# EAGLE design MAX6675-Breakout (EAGLE 5.12)
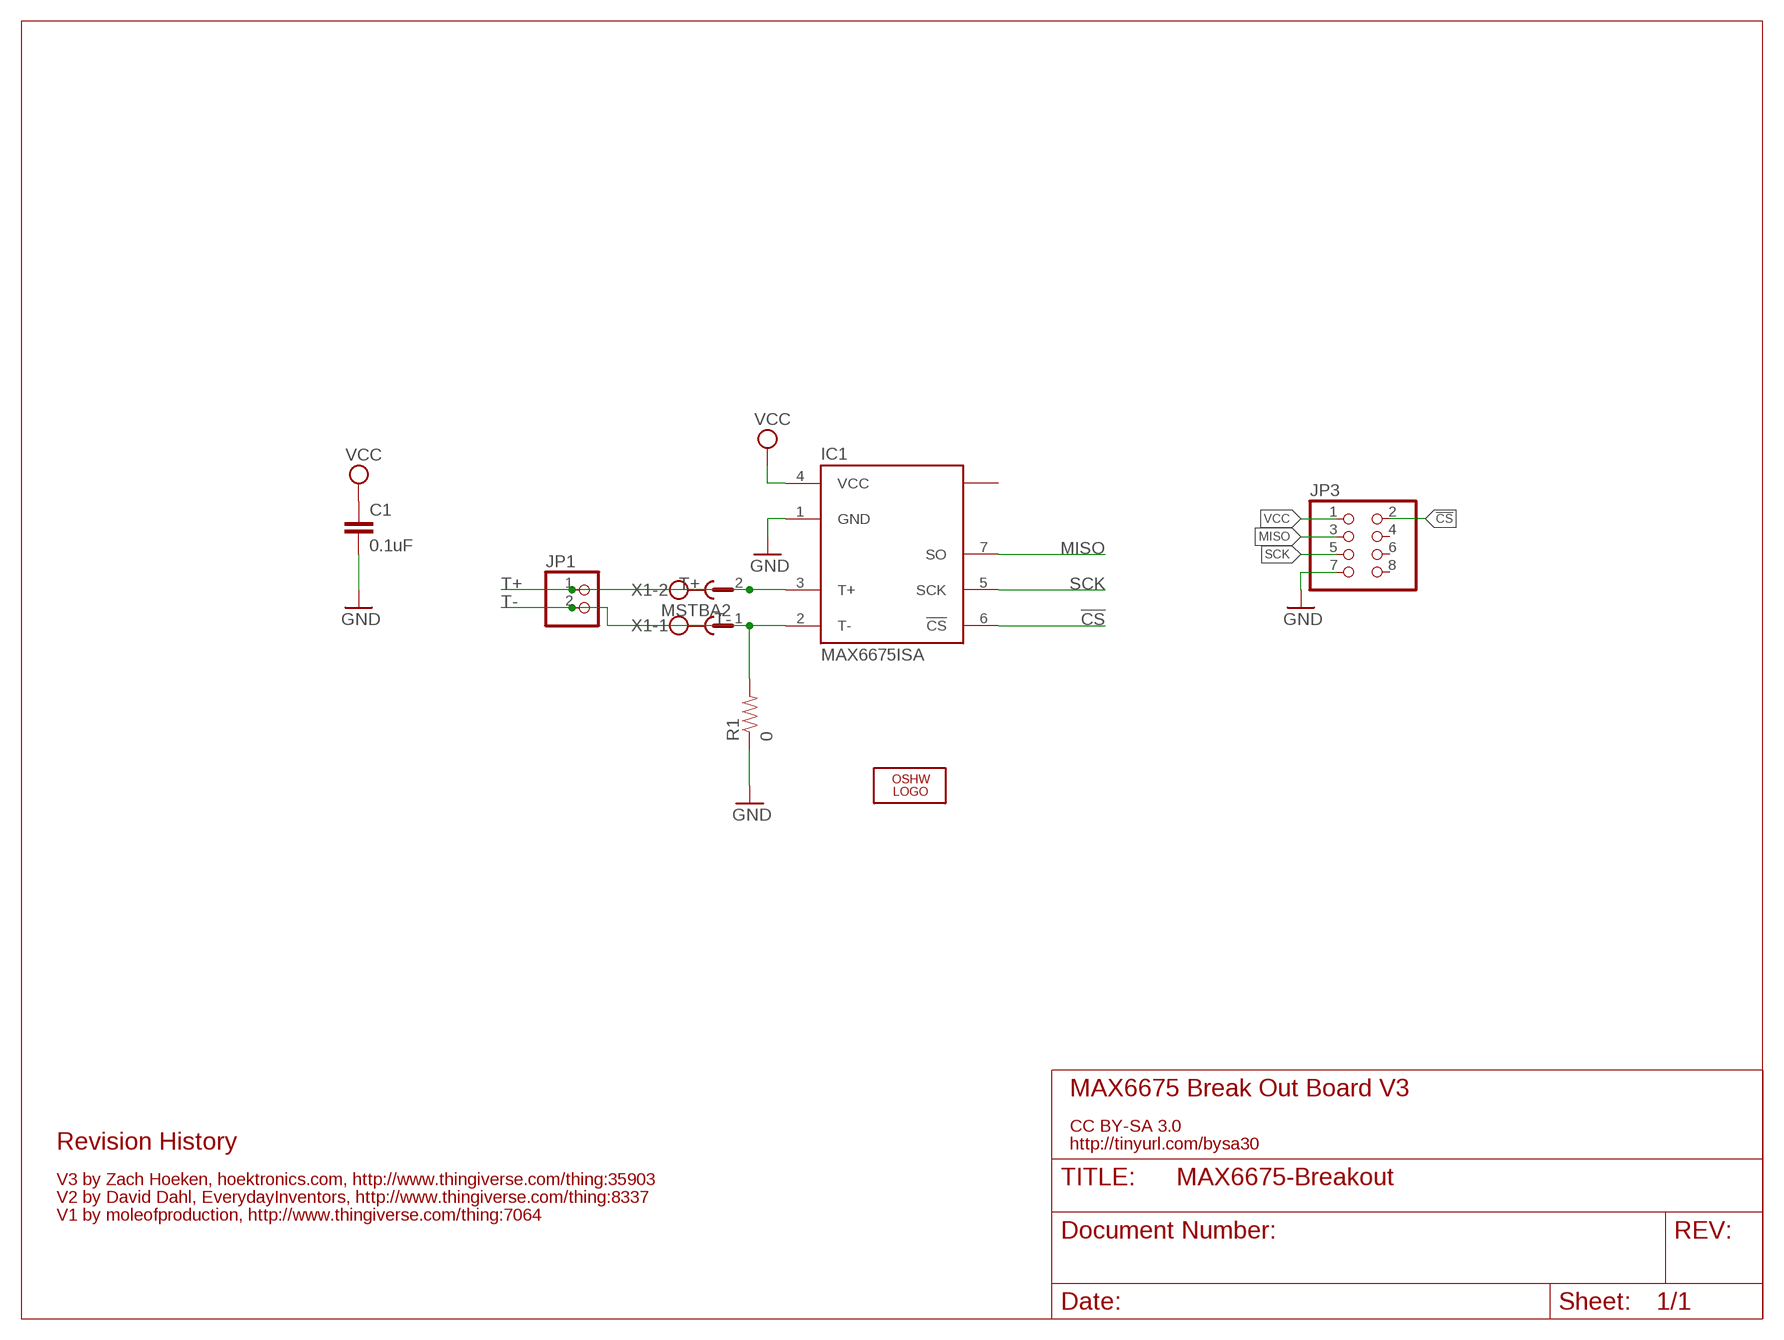
[diagram p0: schematic, sheet 1]

## Parts
C1  0.1uF  CAPACITOR0805  [0805-RC]
IC1  MAX6675ISA  [SO08]
JP1  PINHD-1X2  [1X02]
JP3  PINHD-2X4/90  [2X04/90]
LOGO1  OSHW_LOGO_6MILX0100-NT  [OSHW_6X100_NOTEXT]
R1  0  RESISTOR0805  [0805-RC]
X1  MSTBA2  [MSTBA2]

## Nets
!CS: IC1.6(!CS) JP3.2
GND: C1.2 IC1.1(GND) JP3.7 R1.1
MISO: IC1.7(SO) JP3.3
SCK: IC1.5(SCK) JP3.5
T+: IC1.3(T+) JP1.1 X1.2
T-: IC1.2(T-) JP1.2 R1.2 X1.1
VCC: C1.1 IC1.4(VCC) JP3.1
Unconnected: IC1.8(NC) JP3.4 JP3.6 JP3.8

## Notes on the sheet
- MAX6675 Break Out Board V3
- CC BY-SA 3.0
- Revision History | http://tinyurl.com/bysa30
- V3 by Zach Hoeken, hoektronics.com, http://www.thingiverse.com/thing:35903
- V2 by David Dahl, EverydayInventors, http://www.thingiverse.com/thing:8337
- V1 by moleofproduction, http://www.thingiverse.com/thing:7064

## Library data of the parts
C1 = Hoektronics:CAPACITOR: Capacitor Standard 0603 ceramic capacitor, and 0.1" leaded capacitor.
IC1 = ei-thermocouple:MAX6675ISA: Maxim Cold-Junction-Compensated K-Thermocouple-to-Digital Converter (0C to +1024C)
JP1 = pinhead:PINHD-1X2: PIN HEADER
JP3 = pinhead:PINHD-2X4: PIN HEADER
LOGO1 = ohw-logo:OSHW_LOGO_6MIL
R1 = Hoektronics:RESISTOR: Resistor Basic schematic elements and footprints for 0603, 1206, and PTH 1/10th watt (small) resistors.
X1 = con-phoenix-508:MSTBA2: PHOENIX; MF: FARNELL; MPN: 1757242; OC_FARNELL: 3705171; OC_NEWARK: 71C4161

## Board
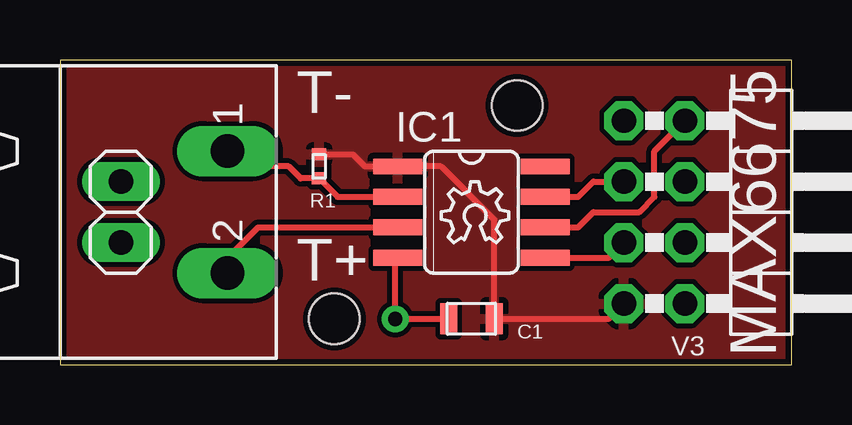
[diagram p1: board, top side]
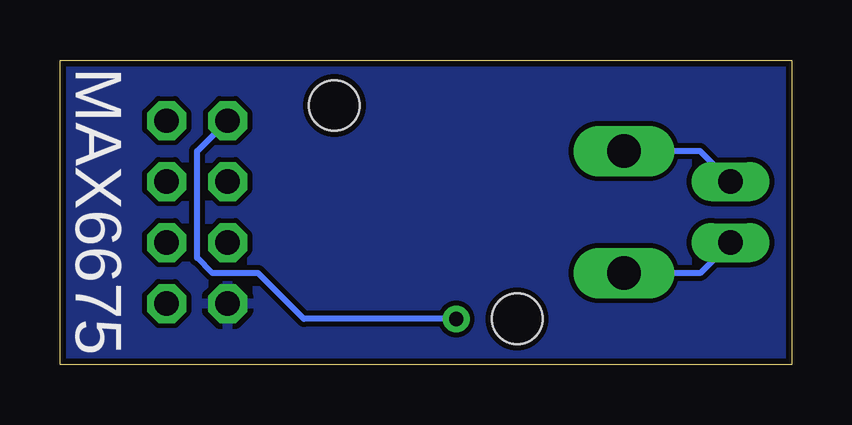
[diagram p2: board, bottom side, seen from below]

Size 30.48 x 12.69 mm. Coordinates in mm from the lower left corner, seen from the top.
Outline: 0,0 30.48,0 30.48,12.69 0,12.69 0,0
Copper layers (1*16): Top 0.035mm / dielectric 1.5mm / Bottom 0.035mm
Design rules "hoektronics": minimum track width 8mil, minimum drill 20mil, track to track 8mil, track to pad 8mil, pad to pad 8mil, via to via 8mil, smd to smd 8mil, copper to edge 10mil, drill to drill 8mil, minimum pad ring 12mil, minimum via ring 10mil, stop-mask expansion 4mil, vias tented up to drill 25mil, thermal gap 10mil
Holes 2.1 mm at 11.43,1.91 19.05,10.79

### Footprints (pad centres in the part's own frame; a part is rotated, then mirrored left to right if it is on the bottom)
0805-RC = smd 0.7 x 1.3: 1 -0.95,0; 2 0.95,0
SO08 = smd 0.66 x 2.032: 1 -1.905,-3.073; 2 -0.635,-3.073; 3 0.635,-3.073; 4 1.905,-3.073; 5 1.905,3.073; 6 0.635,3.073; 7 -0.635,3.073; 8 -1.905,3.073
1X02 = drill 1.016 long: 1 -1.27,0; 2 1.27,0
2X04/90 = drill 1.016 octagon: 1 -3.81,-6.35; 2 -3.81,-3.81; 3 -1.27,-6.35; 4 -1.27,-3.81; 5 1.27,-6.35; 6 1.27,-3.81; 7 3.81,-6.35; 8 3.81,-3.81
0402-RC = smd 0.5 x 0.6: 1 -0.5,0; 2 0.5,0
MSTBA2 = drill 1.397 long: 1 -2.54,5.08; 2 2.54,5.08

### Placement (x,y rotation side)
C1  17.14,1.91 0 top
IC1  17.14,6.35 270 top
JP1  2.54,6.35 90 top
JP3  29.84,6.35 270 top
LOGO1  15.88,5.08 0 top
R1  0  [0402-RC]  10.79,8.26 270 top
X1  1.91,6.35 270 top

### Tracks (layer width: path | path; a pad name or v marks a point on that pad's centre or on a via)
!CS
  Top 0.254: JP3.2 24.77,8.89 24.77,6.99 24.13,6.35 22.23,6.35 21.59,5.71 IC1.6
GND
  Top 0.254: JP3.7 22.86,1.91 C1.2 18.09,6.04 15.88,8.26 IC1.1 12.7,8.26 12.2,8.76 R1.1
  pour Bottom: -0.64,13.34 31.11,13.34 31.11,-0.64 -0.64,-0.64
  pour Top: -0.64,13.34 31.11,13.34 31.11,-0.64 -0.64,-0.64
MISO
  Top 0.254: IC1.7 21.59,6.99 22.23,7.62 JP3.3
SCK
  Top 0.254: IC1.5 22.86,4.45 JP3.5
T+
  Top 0.254: IC1.3 8.26,5.71 6.99,4.45 X1.2
  Bottom 0.254: JP1.1 3.81,3.81 X1.2
T-
  Top 0.254: IC1.2 11.56,6.99 R1.2 10.03,7.75 9.53,8.26 7.62,8.26 X1.1
  Bottom 0.254: JP1.2 3.81,8.89 X1.1
VCC  (via drill 0.6)
  Top 0.254: IC1.4 13.97,4.34 v13.97,1.91 C1.1
  Bottom 0.254: JP3.1 24.77,8.89 24.77,4.45 24.13,3.81 22.23,3.81 20.32,1.91 v13.97,1.91

### Text on the board
tPlace: T- | T+ | V3 | MAX6675
bPlace: MAX6675